# EAGLE design MPPT3 (EAGLE 7.2.0)
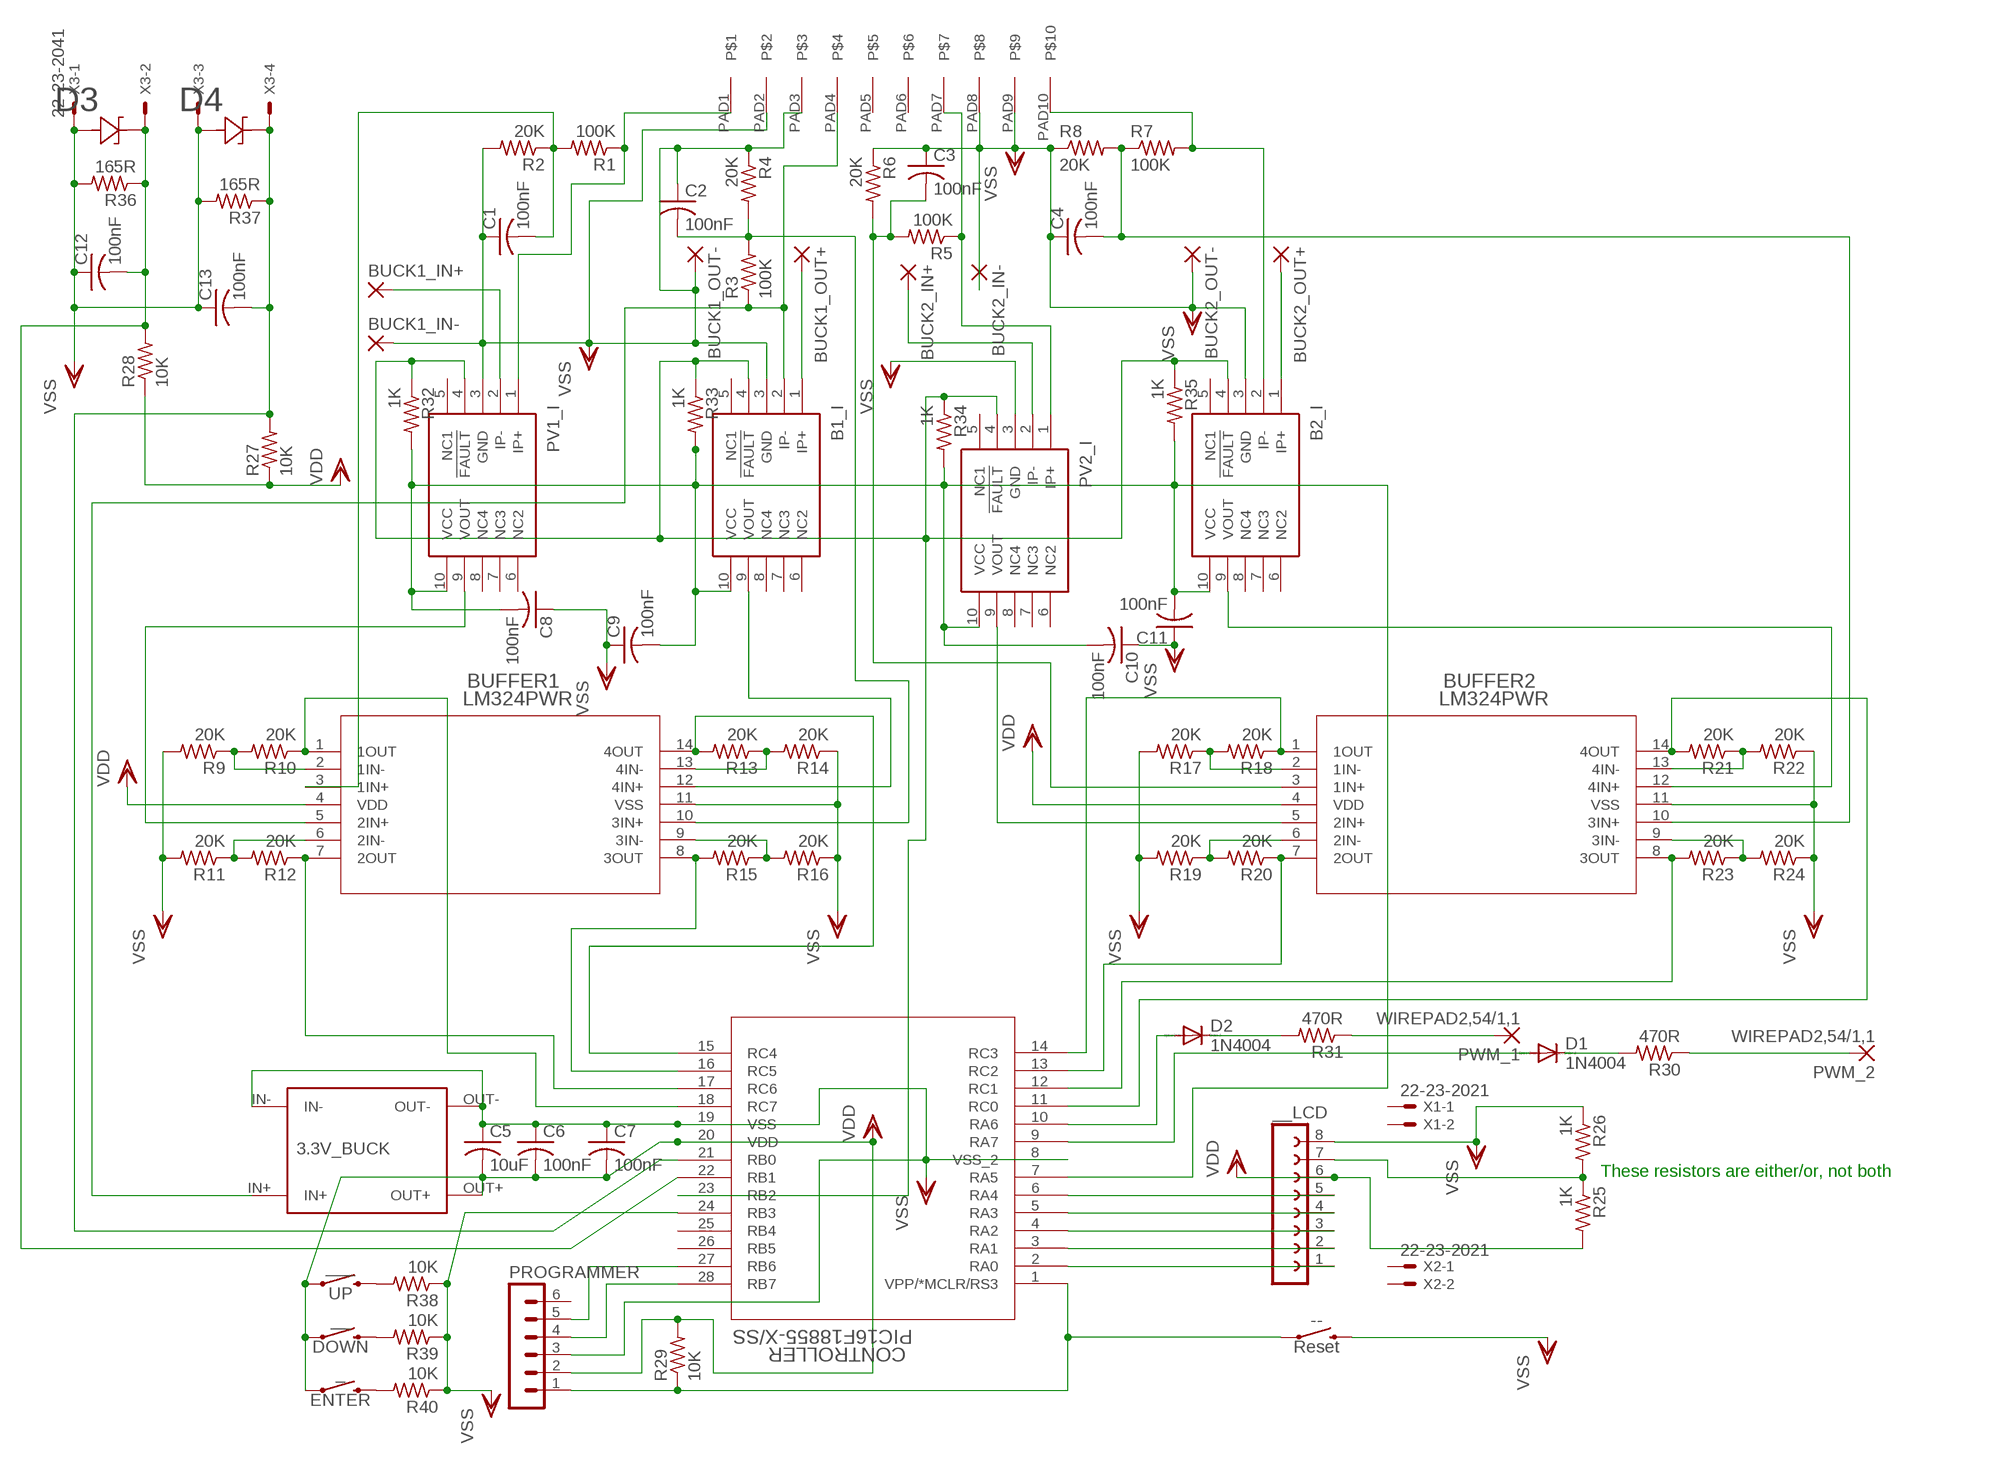
[diagram p0: schematic, sheet 1]

## Parts
3.3V_BUCK  TINY_BUCK  [TINY_BUCK]
--  Reset  MOMENTARY-SWITCH-SPST-PTH-6.0MM  [TACTILE_SWITCH_PTH_6.0MM]
_  ENTER  MOMENTARY-SWITCH-SPST-PTH-6.0MM  [TACTILE_SWITCH_PTH_6.0MM]
__  DOWN  MOMENTARY-SWITCH-SPST-PTH-6.0MM  [TACTILE_SWITCH_PTH_6.0MM]
___  UP  MOMENTARY-SWITCH-SPST-PTH-6.0MM  [TACTILE_SWITCH_PTH_6.0MM]
__LCD  FE08-1  [FE08]
B1_I  ACS711KEXLT-15AB-T  [EX-PACKAGE]
B2_I  ACS711KEXLT-15AB-T  [EX-PACKAGE]
BUCK1_IN+  3,81/1,4  [3,81/1,4]
BUCK1_IN-  3,81/1,4  [3,81/1,4]
BUCK1_OUT+  3,81/1,4  [3,81/1,4]
BUCK1_OUT-  3,81/1,4  [3,81/1,4]
BUCK2_IN+  3,81/1,4  [3,81/1,4]
BUCK2_IN-  3,81/1,4  [3,81/1,4]
BUCK2_OUT+  3,81/1,4  [3,81/1,4]
BUCK2_OUT-  3,81/1,4  [3,81/1,4]
BUFFER1  LM324PWR  [PW14]
BUFFER2  LM324PWR  [PW14]
C1  100nF  C-USC0603  [C0603]
C2  100nF  C-USC0603  [C0603]
C3  100nF  C-USC0603  [C0603]
C4  100nF  C-USC0603  [C0603]
C5  10uF  C-USC0603  [C0603]
C6  100nF  C-USC0603  [C0603]
C7  100nF  C-USC0603  [C0603]
C8  100nF  C-USC0603  [C0603]
C9  100nF  C-USC0603  [C0603]
C10  100nF  C-USC0603  [C0603]
C11  100nF  C-USC0603  [C0603]
C12  100nF  C-USC0603  [C0603]
C13  100nF  C-USC0603  [C0603]
CONTROLLER  PIC16F18855-X/SS  [SSOP28_MC]
D1  1N4004  [DO41-10]
D2  1N4004  [DO41-10]
D3  CZRU52C3V3  [CZRU]
D4  CZRU52C3V3  [CZRU]
PROGRAMMER  MA06-1  [MA06-1]
PV1_I  ACS711KEXLT-15AB-T  [EX-PACKAGE]
PV2_I  ACS711KEXLT-15AB-T  [EX-PACKAGE]
PWM_1  WIREPAD2,54/1,1  [2,54/1,1]
PWM_2  WIREPAD2,54/1,1  [2,54/1,1]
R1  100K  R-US_R0603  [R0603]
R2  20K  R-US_R0603  [R0603]
R3  100K  R-US_R0603  [R0603]
R4  20K  R-US_R0603  [R0603]
R5  100K  R-US_R1206  [R1206]
R6  20K  R-US_R0603  [R0603]
R7  100K  R-US_R0603  [R0603]
R8  20K  R-US_R0603  [R0603]
R9  20K  R-US_R0603  [R0603]
R10  20K  R-US_R0603  [R0603]
R11  20K  R-US_R0603  [R0603]
R12  20K  R-US_R0603  [R0603]
R13  20K  R-US_R0603  [R0603]
R14  20K  R-US_R0603  [R0603]
R15  20K  R-US_R0603  [R0603]
R16  20K  R-US_R0603  [R0603]
R17  20K  R-US_R0603  [R0603]
R18  20K  R-US_R0603  [R0603]
R19  20K  R-US_R0603  [R0603]
R20  20K  R-US_R0603  [R0603]
R21  20K  R-US_R0603  [R0603]
R22  20K  R-US_R0603  [R0603]
R23  20K  R-US_R0603  [R0603]
R24  20K  R-US_R0603  [R0603]
R25  1K  R-US_R0603  [R0603]
R26  1K  R-US_R0603  [R0603]
R27  10K  R-US_R1206  [R1206]
R28  10K  R-US_R0603  [R0603]
R29  10K  R-US_R0603  [R0603]
R30  470R  R-US_R0603  [R0603]
R31  470R  R-US_R1206  [R1206]
R32  1K  R-US_R1206  [R1206]
R33  1K  R-US_R1206  [R1206]
R34  1K  R-US_R0603  [R0603]
R35  1K  R-US_R0603  [R0603]
R36  165R  R-US_R0603  [R0603]
R37  165R  R-US_R0603  [R0603]
R38  10K  R-US_R0603  [R0603]
R39  10K  R-US_R0603  [R0603]
R40  10K  R-US_R0603  [R0603]
U$1  CONN-KF2EDG-10(5.08)E-BAYPLUGGABLECONNECTORS  [CONN-KF2EDG-10(5.08)]
X1  22-23-2021  [22-23-2021]
X2  22-23-2021  [22-23-2021]
X3  22-23-2041  [22-23-2041]

## Nets
N$1: BUCK1_IN+.1(P) PV1_I.2(IP-)
N$2: BUFFER1.5(2IN+) PV1_I.9(VOUT)
N$3: BUFFER1.3(1IN+) C1.2 R1.2 R2.1
N$4: ___.3 R38.2
N$5: BUFFER1.10(3IN+) C2.2 R3.2 R4.2
N$6: 3.3V_BUCK.IN+ B1_I.2(IP-) R3.1 U$1.PAD4
N$7: B1_I.9(VOUT) BUFFER1.12(4IN+)
N$8: PV2_I.1(IP+) R5.1 U$1.PAD7
N$9: BUCK2_IN+.1(P) PV2_I.2(IP-)
N$10: __.3 R39.2
N$11: B2_I.2(IP-) R7.2 U$1.PAD10
N$12: BUFFER2.10(3IN+) C4.2 R7.1 R8.2
N$13: B2_I.1(IP+) BUCK2_OUT+.1(P)
N$14: BUFFER1.9(3IN-) R15.1 R16.2
N$15: BUFFER1.1(1OUT) CONTROLLER.18(RC7) R10.1
N$16: BUFFER1.6(2IN-) R11.1 R12.2
N$17: BUFFER1.7(2OUT) CONTROLLER.17(RC6) R12.1
N$18: BUFFER1.13(4IN-) R13.1 R14.2
N$19: BUFFER1.2(1IN-) R9.1 R10.2
N$20: BUFFER1.14(4OUT) CONTROLLER.15(RC4) R13.2
N$21: BUFFER1.8(3OUT) CONTROLLER.16(RC5) R15.2
N$22: B1_I.1(IP+) BUCK1_OUT+.1(P)
N$23: __LCD.1 CONTROLLER.2(RA0)
N$24: BUFFER2.1(1OUT) CONTROLLER.14(RC3) R18.1
N$25: BUFFER2.7(2OUT) CONTROLLER.13(RC2) R20.1
N$26: BUFFER2.6(2IN-) R19.1 R20.2
N$27: BUFFER2.14(4OUT) CONTROLLER.11(RC0) R21.2
N$28: BUFFER2.13(4IN-) R21.1 R22.2
N$29: BUFFER2.8(3OUT) CONTROLLER.12(RC1) R23.2
N$30: BUFFER2.9(3IN-) R23.1 R24.2
N$31: BUFFER2.2(1IN-) R17.1 R18.2
N$32: BUFFER2.5(2IN+) PV2_I.9(VOUT)
N$33: B2_I.9(VOUT) BUFFER2.12(4IN+)
N$34: __LCD.2 CONTROLLER.3(RA1)
N$35: __LCD.3 CONTROLLER.4(RA2)
N$36: __LCD.4 CONTROLLER.5(RA3)
N$37: __LCD.5 CONTROLLER.6(RA4)
N$38: __LCD.7 R25.1 R26.2
N$39: C12.2 CONTROLLER.22(RB1) D3.1 R28.2 R36.1 X3.2
N$40: --.1 CONTROLLER.1(VPP/*MCLR/RS3) PROGRAMMER.1 R29.1
N$41: CONTROLLER.10(RA6) D2.A
N$42: C13.2 CONTROLLER.21(RB0) D4.1 R27.2 R37.1 X3.4
N$43: CONTROLLER.9(RA7) D1.A
N$44: CONTROLLER.28(RB7) PROGRAMMER.4
N$45: CONTROLLER.27(RB6) PROGRAMMER.5
N$46: PWM_2.1(P) R30.1
N$47: D1.C R30.2
N$48: PWM_1.1(P) R31.1
N$49: D2.C R31.2
N$50: PV1_I.1(IP+) R1.1 U$1.PAD1
N$51: _.3 R40.2
N$52: BUFFER2.3(1IN+) C3.2 R5.2 R6.2
N$53: B1_I.10(VCC) B2_I.10(VCC) C8.2 C9.2 C10.2 C11.2 CONTROLLER.7(RA5) PV1_I.10(VCC) PV2_I.10(VCC) R32.2 R33.2 R34.2 R35.2
N$56: B1_I.4(!FAULT) B2_I.4(!FAULT) CONTROLLER.23(RB2) PV1_I.4(!FAULT) PV2_I.4(!FAULT) R32.1 R33.1 R34.1 R35.1
VDD: 3.3V_BUCK.OUT+ _.1 __.1 ___.1 __LCD.6 BUFFER1.4(VDD) BUFFER2.4(VDD) C5.2 C6.2 C7.2 CONTROLLER.20(VDD) PROGRAMMER.2 R25.2 R27.1 R28.1 R29.2
VSS: 3.3V_BUCK.IN- 3.3V_BUCK.OUT- --.3 __LCD.8 B1_I.3(GND) B2_I.3(GND) BUCK1_IN-.1(P) BUCK1_OUT-.1(P) BUCK2_IN-.1(P) BUCK2_OUT-.1(P) BUFFER1.11(VSS) BUFFER2.11(VSS) C1.1 C2.1 C3.1 C4.1 C5.1 C6.1 C7.1 C8.1 C9.1 C10.1 C11.1 C12.1 C13.1 CONTROLLER.8(VSS_2) CONTROLLER.19(VSS) CONTROLLER.24(RB3) D3.2 D4.2 PROGRAMMER.3 PV1_I.3(GND) PV2_I.3(GND) R2.2 R4.1 R6.1 R8.1 R9.2 R11.2 R14.1 R16.1 R17.2 R19.2 R22.1 R24.1 R26.1 R36.2 R37.2 R38.1 R39.1 R40.1 U$1.PAD2 U$1.PAD3 U$1.PAD8 U$1.PAD9 X3.1 X3.3
Unconnected: B1_I.5(NC1) B1_I.6(NC2) B1_I.7(NC3) B1_I.8(NC4) B2_I.5(NC1) B2_I.6(NC2) B2_I.7(NC3) B2_I.8(NC4) CONTROLLER.25(RB4) CONTROLLER.26(RB5) PROGRAMMER.6 PV1_I.5(NC1) PV1_I.6(NC2) PV1_I.7(NC3) PV1_I.8(NC4) PV2_I.5(NC1) PV2_I.6(NC2) PV2_I.7(NC3) PV2_I.8(NC4) U$1.PAD5 U$1.PAD6 X1.1 X1.2 X2.1 X2.2

## Notes on the sheet
- These resistors are either/or, not both

## Library data of the parts
3.3V_BUCK = Tiny_Buck:TINY_BUCK: E_Bay 3 Amp Buck Converter
-- _ __ ___ = SparkFun-Switches:MOMENTARY-SWITCH-SPST: Momentary Switch (Pushbutton) - SPST Normally-open (NO) SPST momentary switches (buttons, pushbuttons). Variants PTH-12MM - 12mm square, through-hole Momentary Pushbutton Switch - 12mm Square <https://www.sparkfun.com/products/9190> (COM-09190) PTH-6.0MM, PTH-6.0MM-KIT - 6.0mm square, through-hole Mini Pushbutton Switch <https://www.sparkfun.com/products/97> (COM-00097) KIT package intended for soldering kit's - only one side of pads' copper is exposed. PTH-RIGHT-ANGLE-KIT - Right-angle, through-hole Right Angle Tactile Button <https://www.sparkfun.com/products/10791> - Used on SparkFun BigTime Watch Kit <https://www.sparkfun.com/products/11734> SMD-12MM - 12mm square, surface-mount Tactile Button - SMD (12mm) <https://www.sparkfun.com/products/12993> (COM-12993) Used on SparkFun PicoBoard <https://www.sparkfun.com/products/11888> SMD-4.5MM - 4.5mm Square Trackball Switch Used on SparkFun Blackberry Trackballer Breakout <https://www.sparkfun.com/products/13169> SMD-4.6MMX2.8MM - 4.60mm x 2.80mm, surface mount Used on SparkFun SAMD21 Mini Breakout <https://www.sparkfun.com/products/13664> SMD-5.2MM, SMD-5.2-REDUNDANT - 5.2mm square, surface-mount Mini Pushbutton Switch - SMD <https://www.sparkfun.com/products/8720> (COM-08720) Used on Arduino Pro Mini <https://www.sparkfun.com/products/11114> REDUNDANT package connects both switch circuits together SMD-6.0X3.5MM - 6.0 x 3.5mm, surface mount Momentary Reset Switch SMD <https://www.sparkfun.com/products/8229> (COM-08229) SMD-6.2MM-TALL - 6.2mm square, surface mount Tactile Button - SMD (6mm) <https://www.sparkfun.com/products/12992> Used on SparkFun Digital Sandbox <https://www.sparkfun.com/products/12651> SMD-RIGHT-ANGLE - Right-angle, surface mount Used on SparkFun Block for Intel® Edison - Arduino <https://www.sparkfun.com/products/13036>; PROD_ID: SWCH-08441; SF_SKU: COM-00097
__LCD = con-lsta:FE08-1: FEMALE HEADER; OC_FARNELL: unknown; OC_NEWARK: unknown
B1_I B2_I PV1_I PV2_I = SamacSys_Parts:ACS711KEXLT-15AB-T: Hall Effect Linear Current Sensor with Overcurrent Fault Output for <100 V Isolation Applications Source: Datasheet <https://www.arrow.com/en/products/acs711kexlt-15ab-t/allegro-microsystems>; ARROW_PART_NUMBER: ACS711KEXLT-15AB-T; DESCRIPTION: Hall Effect Linear Current Sensor with Overcurrent Fault Output for <100 V Isolation Applications; HEIGHT: mm; MANUFACTURER_NAME: Allegro Microsystems; MANUFACTURER_PART_NUMBER: ACS711KEXLT-15AB-T
BUCK1_IN+ BUCK1_IN- BUCK1_OUT+ BUCK1_OUT- BUCK2_IN+ BUCK2_IN- BUCK2_OUT+ BUCK2_OUT- = wirepad:3,81/1,4: THROUGH-HOLE PAD
BUFFER1 BUFFER2 = LM324PWR:LM324PWR; MANUFACTURER_PART_NUMBER: LM324PWR; VENDOR: Vendor
C1-C13 = resistor:C-US: CAPACITOR, American symbol
CONTROLLER = 16F18855_SSOP:PIC16F18855-X/SS; COPYRIGHT: Copyright (C) 2016 Accelerated Designs. All rights reserved; MANUFACTURER_PART_NUMBER: pic16f18855-x/ss; VENDOR: Microchip
D1 D2 = diode:1N4004: DIODE general purpose rectifier, 1 A
D3 D4 = 0603ZenerDiode:CZRU52C3V3; VENDOR: Comchip
PROGRAMMER = con-lstb:MA06-1: PIN HEADER; OC_FARNELL: unknown; OC_NEWARK: unknown
PWM_1 PWM_2 = wirepad:WIREPAD: Wire PAD connect wire on PCB
R1-R26 R28-R40 = resistor:R-US_: RESISTOR, American symbol
R27 = rcl:R-US_: RESISTOR, American symbol
U$1 = Stuff_I_Use:CONN-KF2EDG-10(5.08)
X1 X2 = con-molex:22-23-2021: .100" (2.54mm) Center Header - 2 Pin; MF: MOLEX; MPN: 22-23-2021; OC_FARNELL: 1462926; OC_NEWARK: 25C3832
X3 = con-molex:22-23-2041: .100" (2.54mm) Center Header - 4 Pin; MF: MOLEX; MPN: 22-23-2041; OC_FARNELL: 1462920; OC_NEWARK: 38C0355

## Board
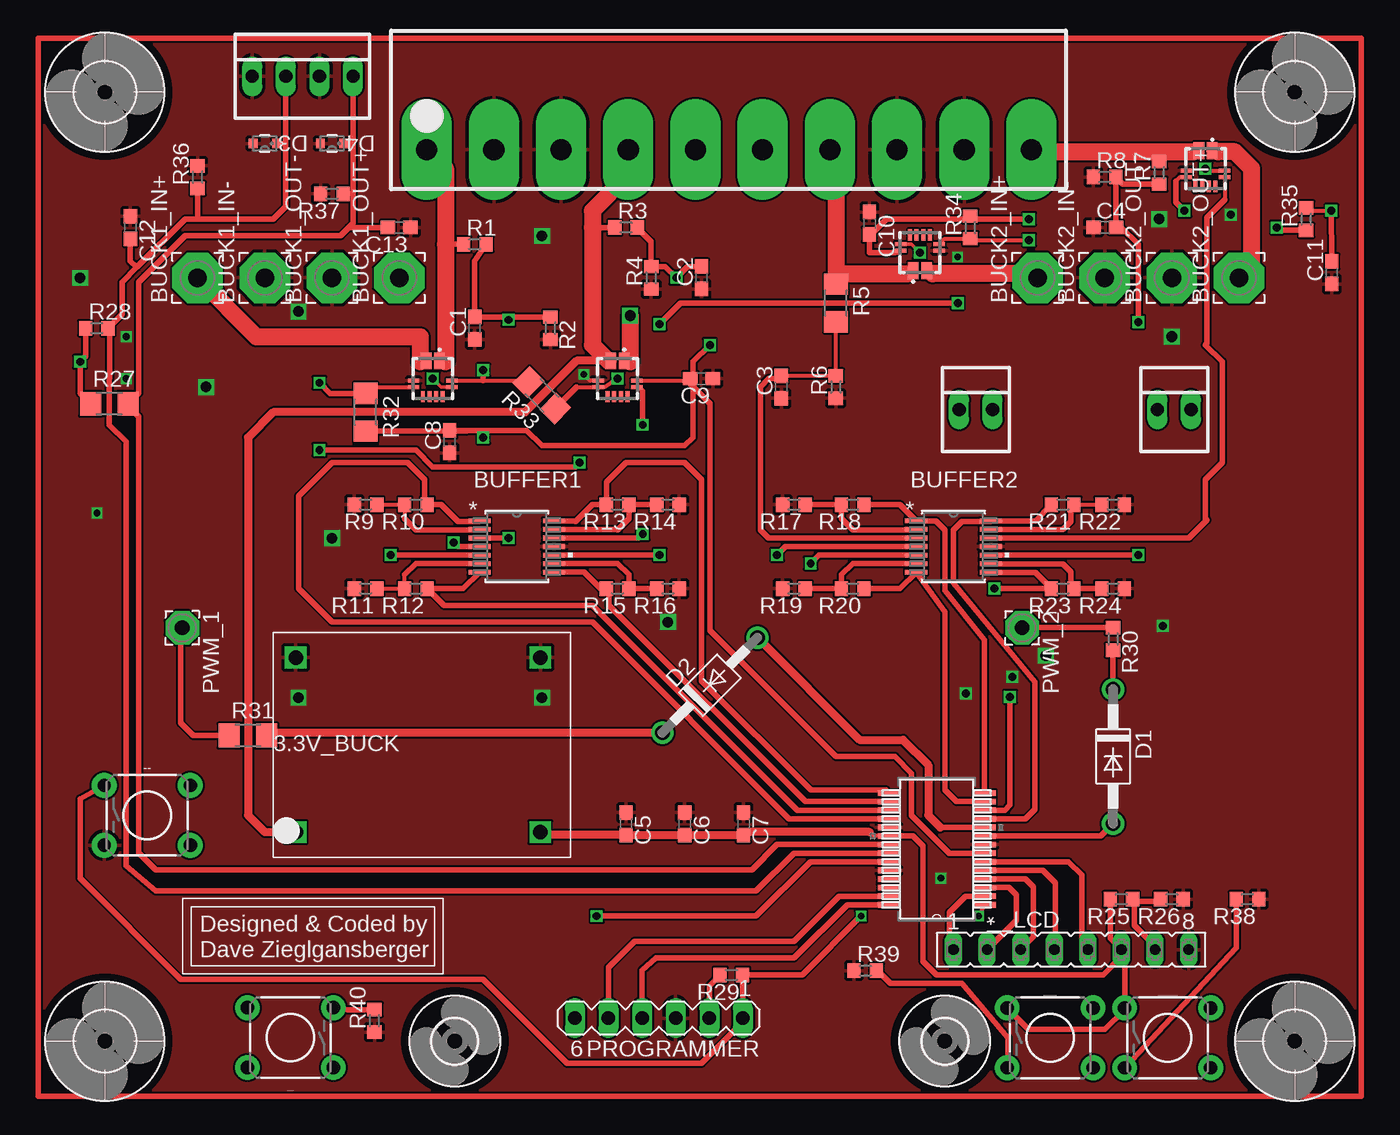
[diagram p1: board, top side]
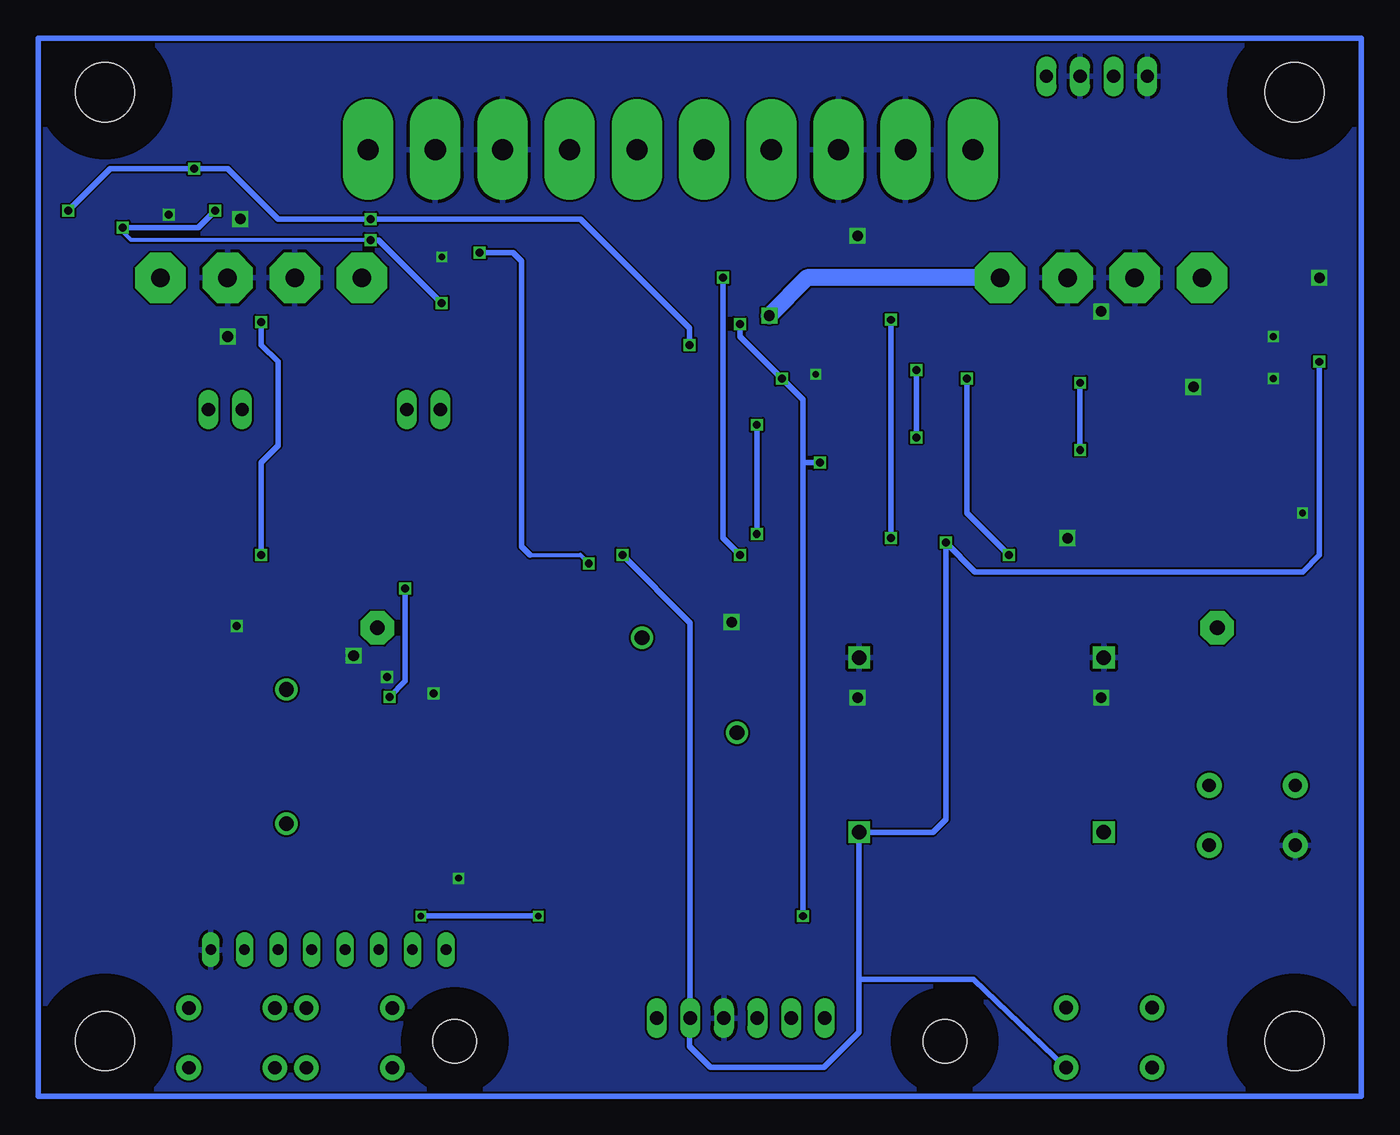
[diagram p2: board, bottom side, seen from below]

No outline drawn. Coordinates in mm, seen from the top.
Copper layers (1*16): Top 0.035mm / dielectric 1.5mm / Bottom 0.035mm
Design rules "SeeedStudio_2layer_DRU_no_angle_20140221 *": minimum track width 6mil, minimum drill 12mil, track to track 6mil, track to pad 6mil, pad to pad 6mil, via to via 6mil, smd to smd 0mil, copper to edge 10mil, drill to drill 10mil, minimum pad ring 10mil, minimum via ring 6mil, stop-mask expansion 2mil, vias tented up to drill 100mil, thermal gap 10mil

### Footprints (pad centres in the part's own frame; a part is rotated, then mirrored left to right if it is on the bottom)
TINY_BUCK = drill 1.1 square: IN+ 1.7,1.9; IN- 1.7,15.1; OUT+ 20.2,1.9; OUT- 20.2,15.1
TACTILE_SWITCH_PTH_6.0MM = drill 1.016 pad 1.88: 1 -3.251,2.261; 2 3.251,2.261; 3 -3.251,-2.261; 4 3.251,-2.261
FE08 = drill 0.813 long: 1 -8.89,0; 2 -6.35,0; 3 -3.81,0; 4 -1.27,0; 5 1.27,0; 6 3.81,0; 7 6.35,0; 8 8.89,0
EX-PACKAGE = smd 1.27 x 0.8: 1 -1.35,0.5; 2 -1.35,-0.5 | smd 0.3 x 0.85: 3 0.15,-1.45; 4 0.65,-1.45; 9 0.65,1.45; 10 0.15,1.45 | smd 0.85 x 0.3: 5 1.35,-0.75; 6 1.35,-0.25; 7 1.35,0.25; 8 1.35,0.75
3,81/1,4 = drill 1.397 pad 3.81 octagon: 1 0,0
PW14 = smd 1.676 x 0.356: 1 -2.819,1.95; 2 -2.819,1.3; 3 -2.819,0.65; 4 -2.819,0; 5 -2.819,-0.65; 6 -2.819,-1.3; 7 -2.819,-1.95; 8 2.819,-1.95; 9 2.819,-1.3; 10 2.819,-0.65; 11 2.819,0; 12 2.819,0.65; 13 2.819,1.3; 14 2.819,1.95
C0603 = smd 1.1 x 1: 1 -0.85,0; 2 0.85,0
SSOP28_MC = smd 1.676 x 0.432: 1 -3.619,4.225; 2 -3.619,3.575; 3 -3.619,2.925; 4 -3.619,2.275; 5 -3.619,1.625; 6 -3.619,0.975; 7 -3.619,0.325; 8 -3.619,-0.325; 9 -3.619,-0.975; 10 -3.619,-1.625; 11 -3.619,-2.275; 12 -3.619,-2.925; 13 -3.619,-3.575; 14 -3.619,-4.225; 15 3.619,-4.225; 16 3.619,-3.575; 17 3.619,-2.925; 18 3.619,-2.275; 19 3.619,-1.625; 20 3.619,-0.975; 21 3.619,-0.325; 22 3.619,0.325; 23 3.619,0.975; 24 3.619,1.625; 25 3.619,2.275; 26 3.619,2.925; 27 3.619,3.575; 28 3.619,4.225
DO41-10 = drill 1.118: A 5.08,0; C -5.08,0
CZRU = smd 0.66 x 0.711: 1 -0.876,0; 2 0.876,0
MA06-1 = drill 1.016 long: 1 -6.35,0; 2 -3.81,0; 3 -1.27,0; 4 1.27,0; 5 3.81,0; 6 6.35,0
2,54/1,1 = drill 1.118 pad 2.54 octagon: 1 0,0
R0603 = smd 1 x 1.1: 1 -0.85,0; 2 0.85,0
R1206 = smd 1.6 x 1.803: 1 -1.422,0; 2 1.422,0
CONN-KF2EDG-10(5.08) = drill 1.6 pad 3.81 long: PAD1 23.32,3; PAD2 18.24,3; PAD3 13.16,3; PAD4 8.08,3; PAD5 3,3; PAD6 -2.08,3; PAD7 -7.16,3; PAD8 -12.24,3; PAD9 -17.32,3; PAD10 -22.4,3
4,5 = hole 4.5: 0,0
3,3 = hole 3.3: 0,0
22-23-2021 = drill 1 long: 1 -1.27,0; 2 1.27,0
22-23-2041 = drill 1 long: 1 -3.81,0; 2 -1.27,0; 3 1.27,0; 4 3.81,0

### Placement (x,y rotation side)
3.3V_BUCK  17.75,18.08 0 top
--  8.22,21.26 0 top
_  19.05,4.45 180 top
__  76.49,4.43 0 top
___  85.38,4.43 0 top
__LCD  78.08,11.1 0 top
B1_I  43.78,54.28 270 top
B2_I  88.23,70.15 270 top
BUCK1_IN+  12.04,61.9 90 top
BUCK1_IN-  17.11,61.9 90 top
BUCK1_OUT+  27.27,61.9 90 top
BUCK1_OUT-  22.2,61.9 90 top
BUCK2_IN+  75.53,61.9 90 top
BUCK2_IN-  80.61,61.9 90 top
BUCK2_OUT+  90.78,61.9 90 top
BUCK2_OUT-  85.69,61.9 90 top
BUFFER1  36.16,41.58 0 top
BUFFER2  69.19,41.58 0 top
C1  32.99,58.09 90 top
C2  50.13,61.9 90 top
C3  56.17,53.64 90 top
C4  80.61,65.71 0 top
C5  44.42,20.62 270 top
C6  48.87,20.62 270 top
C7  53.31,20.62 270 top
C8  31.09,49.52 90 top
C9  50.13,54.28 180 top
C10  62.84,66.03 270 top
C11  97.79,62.28 90 top
C12  6.96,65.71 270 top
C13  27.27,65.71 180 top
CONTROLLER  67.92,18.72 180 top
D1  81.25,25.7 270 top
D2  50.77,31.1 45 top
D3  17.11,72.06 180 top
D4  22.2,72.06 180 top
PROGRAMMER  46.91,5.92 180 top
PV1_I  29.82,54.28 270 top
PV2_I  66.64,63.8 90 top
PWM_1  10.88,35.44 270 top
PWM_2  74.38,35.44 270 top
R1  32.99,64.44 0 top
R2  38.7,58.09 270 top
R3  44.42,65.71 0 top
R4  46.33,61.9 90 top
R5  60.3,59.99 270 top
R6  60.3,53.64 90 top
R7  84.74,69.83 90 top
R8  80.61,69.52 0 top
R9  24.73,44.75 180 top
R10  28.55,44.75 180 top
R11  24.73,38.4 180 top
R12  28.55,38.4 180 top
R13  43.78,44.75 180 top
R14  47.59,44.75 180 top
R15  43.78,38.4 180 top
R16  47.59,38.4 180 top
R17  57.12,44.75 180 top
R18  61.56,44.75 180 top
R19  57.12,38.4 180 top
R20  61.56,38.4 180 top
R21  77.44,44.75 180 top
R22  81.25,44.75 180 top
R23  77.44,38.4 180 top
R24  81.25,38.4 180 top
R25  81.89,14.91 180 top
R26  85.69,14.91 180 top
R27  5.37,52.37 0 top
R28  4.42,58.09 0 top
R29  52.39,9.18 180 top
R30  81.25,34.59 270 top
R31  15.85,27.29 0 top
R32  24.73,51.74 270 top
R33  38.07,53.01 135 top
R34  70.45,65.71 90 top
R35  95.86,66.34 90 top
R36  12.04,69.52 90 top
R37  22.2,68.25 180 top
R38  91.41,14.91 180 top
R39  62.52,9.51 0 top
R40  25.4,5.71 90 top
U$1  52.67,74.6 180 top
U$2  [4,5]  5.03,75.94 0 top
U$3  [4,5]  94.97,4.19 0 top
U$4  [4,5]  5.03,4.19 0 top
U$5  [4,5]  94.97,75.94 0 top
U$7  [DAVE]  12.18,10.53 0 top
U$8  [3,3]  31.48,4.19 0 top
U$9  [3,3]  68.53,4.19 0 top
X1  70.88,51.94 0 top
X2  85.88,51.94 0 top
X3  19.97,77.14 0 top

### Tracks (layer width: path | path; a pad name or v marks a point on that pad's centre or on a via)
N$1
  Top 0.813: 28.86,55.55 28.94,55.63 PV1_I.2
  Top 1.27: BUCK1_IN+.1 16.48,57.45 28.86,57.45 28.86,55.55
N$2  (via drill 0.6)
  Top 0.254: v29.82,54.28 30.45,53.64 31.25,53.64 PV1_I.9
  Top 0.305: 33.33,40.94 BUFFER1.5
  Top 0.406: v26.64,40.94 33.33,40.94
  Bottom 0.406: v29.82,54.28 29.82,44.12 v26.64,40.94
N$3  (via drill 0.6)
  Top 0.305: 35.52,42.23 v35.53,42.21
  Top 0.406: 35.53,58.94 C1.2 32.99,63.17 R1.2 | 35.53,58.94 R2.1 | v35.53,58.72 35.53,58.94 | BUFFER1.3 33.36,42.21 v35.53,42.21
  Bottom 0.406: v35.53,42.21 v35.53,58.72
N$4
  Top 0.406: R38.2 90.56,11.24 ___.3
N$5  (via drill 0.6)
  Top 0.305: 39,40.94 BUFFER1.10
  Top 0.406: v46.96,40.94 39,40.94 | R3.2 46.33,64.65 R4.2 47.38,62.75 v48.23,61.9 49.08,62.75 C2.2
  Bottom 0.406: v48.23,61.9 48.23,42.21 v46.96,40.94
N$6
  Top 0.406: R3.1 41.88,65.71
  Top 0.61: 43.07,55.63 40.69,55.63 36.8,51.74 17.75,51.74 15.85,49.83 15.85,21.26 17.11,19.99 3.3V_BUCK.IN+
  Top 0.813: 43.07,55.63 B1_I.2
  Top 1.27: 43.07,55.63 41.88,56.82 41.88,65.71 41.88,66.98 44.59,69.69 U$1.PAD4
N$7  (via drill 0.6)
  Top 0.305: B1_I.9 45.39,53.63 45.69,53.33
  Top 0.406: BUFFER1.12 45.39,42.23 v45.69,42.53 | 45.69,53.33 v45.69,50.78
  Bottom 0.406: v45.69,42.53 v45.69,50.78
N$8
  Top 0.813: 65.69,62.22 65.93,62.45 PV2_I.1
  Top 1.27: 65.69,62.22 60.4,62.22 R5.1 60.3,71.14 U$1.PAD7
N$9
  Top 0.813: 67.6,62.22 67.36,62.45 PV2_I.2
  Top 1.27: BUCK2_IN+.1 75.22,62.22 67.6,62.22
N$10
  Top 0.406: __.3 73.31,2.88 73.31,4.43 69.82,8.56 64.42,8.56 63.47,9.51 R39.2
N$11
  Top 0.305: R7.2 84.42,71
  Top 0.406: R7.2 84.74,71.42
  Top 0.813: 87.28,71.42 87.36,71.5 B2_I.2
  Top 1.27: U$1.PAD10 75.25,71.42 84.74,71.42 87.28,71.42
N$12  (via drill 0.6)
  Top 0.305: 72.02,40.94 BUFFER2.10
  Top 0.406: v83.16,40.94 72.02,40.94 | v83.16,58.56 83.16,64.44 81.89,65.71 C4.2 R8.2 82,68.98 R7.1
  Bottom 0.406: v83.16,40.94 83.16,47.93 81.89,49.2 81.89,55.55 83.16,56.82 v83.16,58.56
N$13
  Top 0.813: 89.19,71.42 88.73,71.42 B2_I.1
  Top 1.27: BUCK2_OUT+.1 91.73,62.85 91.73,70.15 90.46,71.42 89.19,71.42
N$14
  Top 0.305: BUFFER1.9 39.01,40.31
  Top 0.406: 39.01,40.31 43.78,40.31 44.63,39.46 R15.1 R16.2
N$15
  Top 0.305: 33.3,43.48 BUFFER1.1 | 29.18,44.97 R10.1
  Top 0.406: R10.1 30.45,44.75 31.72,43.48 33.3,43.48 | CONTROLLER.18 56.75,20.99 41.88,35.86 22.2,35.86 19.66,38.4 19.66,45.39 22.2,47.93 27.91,47.93 29.18,46.66 29.18,44.97
N$16
  Top 0.305: R11.1 R12.2 27.7,39.46 | 33.32,40.31 BUFFER1.6
  Top 0.406: 27.7,39.46 28.55,40.31 33.32,40.31
N$17
  Top 0.305: 33.3,39.67 BUFFER1.7
  Top 0.406: BUFFER1.7 32.12,38.4 R12.1 30.66,37.13 41.88,37.13 57.37,21.64 CONTROLLER.17
N$18
  Top 0.305: 43.76,42.88 43.78,42.85
  Top 0.406: BUFFER1.13 43.76,42.88 | 43.78,42.85 44.63,43.7 R13.1 R14.2
N$19
  Top 0.305: R9.1 R10.2 27.7,43.7 | 33.32,42.85 BUFFER1.2
  Top 0.406: 27.7,43.7 28.55,42.85 33.32,42.85
N$20
  Top 0.305: 40.56,43.53 40.61,43.48 | 64.08,23.16 CONTROLLER.15
  Top 0.406: BUFFER1.14 40.56,43.53 | 40.61,43.48 41.88,44.75 R13.2 42.94,46.44 44.42,47.93 48.87,47.93 50.13,46.66 50.13,31.42 58.39,23.16 64.08,23.16
N$21
  Top 0.305: BUFFER1.8 39.03,39.67 | 42.52,38.4 R15.2 43.15,38.19
  Top 0.406: 39.03,39.67 41.24,39.67 42.52,38.4 | 43.15,38.19 43.15,37.13 57.99,22.29 CONTROLLER.16
N$22  (via drill 0.8)
  Top 0.813: 44.74,55.55 44.37,55.55 B1_I.1
  Top 1.27: v44.74,59.04 44.74,55.55
  Bottom 1.27: BUCK1_OUT+.1 41.88,61.9 v44.74,59.04
N$23
  Top 0.406: CONTROLLER.2 70.08,15.14 68.88,13.94 68.88,11.41 __LCD.1
N$24
  Top 0.305: 71.53,23.13 CONTROLLER.14
  Top 0.406: R18.1 65.14,44.75 BUFFER2.1 67.87,43.53 68.55,42.85 68.55,38.27 71.53,34.5 71.53,23.13
N$25
  Top 0.406: R20.1 65.14,38.4 BUFFER2.7 68.55,36.64 68.55,23.16 69.42,22.29 CONTROLLER.13
N$26
  Top 0.305: 66.34,40.31 BUFFER2.6
  Top 0.406: R19.1 R20.2 60.72,39.46 61.56,40.31 66.34,40.31
N$27
  Top 0.305: 71.96,43.48 BUFFER2.14
  Top 0.406: BUFFER2.14 75.36,43.53 R21.2 | CONTROLLER.11 74.64,20.99 75.33,21.69 75.33,31.36 69.19,38.81 69.19,42.85 69.82,43.48 71.96,43.48
N$28
  Top 0.305: 78.08,44.54 R21.1 R22.2
  Top 0.406: BUFFER2.13 77.47,42.88 78.08,43.48 78.08,44.54
N$29  (via drill 0.6)
  Top 0.406: BUFFER2.8 75.36,39.63 R23.2 v72.27,38.4 | CONTROLLER.12 73.08,21.64 73.47,22.03 v73.47,30.22
  Bottom 0.406: v73.47,30.22 72.27,31.42 v72.27,38.4
N$30
  Top 0.305: 78.08,38.62 R23.1
  Top 0.406: BUFFER2.9 77.47,40.28 78.08,39.67 78.08,38.62 | R23.1 R24.2
N$31
  Top 0.305: 66.34,42.85 BUFFER2.2
  Top 0.406: R17.1 R18.2 60.72,43.7 61.56,42.85 66.34,42.85
N$32  (via drill 0.6)
  Top 0.254: 65.21,64.44 66.01,64.44 v66.64,63.8
  Top 0.305: 66.35,40.94 BUFFER2.5 | PV2_I.9 65.21,64.44
  Top 0.406: v58.39,40.31 59.02,40.94 66.35,40.94
  Bottom 0.305: 62.84,40.94 59.02,40.94 v58.39,40.31
  Bottom 0.406: 62.84,40.94 63.47,41.58 63.47,63.17 64.11,63.8 v66.64,63.8
N$33
  Top 0.305: B2_I.9 89.69,67.79 | 72.02,42.21 BUFFER2.12
  Top 0.406: 89.69,67.79 88.33,66.44 88.33,56.92 88.23,56.82 89.5,55.55 89.5,47.93 88.23,46.66 88.23,43.68 88.33,43.58 86.97,42.21 72.02,42.21
N$34
  Top 0.406: CONTROLLER.3 73.38,15.79 73.95,15.22 73.95,13.32 __LCD.2
N$35
  Top 0.406: CONTROLLER.4 74.64,16.44 75.22,15.86 75.22,12.05 __LCD.3
N$36
  Top 0.406: CONTROLLER.5 75.94,17.09 76.88,16.16 76.88,11.17 __LCD.4
N$37
  Top 0.406: CONTROLLER.6 77.88,17.74 78.88,16.75 78.88,11.57 __LCD.5
N$38
  Top 0.406: __LCD.7 84.42,11.39 82.88,12.94 82.88,14.77 | 82.88,14.77 R25.1 | 82.88,14.77 84.7,14.77 R26.2
N$39
  Top 0.406: 7.43,62.69 11.08,66.34 12.04,66.34 | 7.43,62.69 6.32,61.58 6.32,59.14 R28.2 5.37,57.67 5.36,50.78 6.64,49.51 6.64,17.45 8.86,15.54 54.26,15.54 57.11,18.39 CONTROLLER.22 | 12.04,66.34 17.75,66.34 18.7,67.3 18.7,72.06 | 18.7,72.06 X3.2 | D3.1 18.7,72.06 | R36.1 12.04,66.34 | C12.2 6.96,63.17 7.43,62.69
N$40  (via drill 0.5)
  Top 0.305: CONTROLLER.1 v71.09,13.64
  Top 0.406: v62.2,13.64 57.76,9.19 R29.1 PROGRAMMER.1 53.26,5.65 50.13,2.52 39.98,2.52 33.62,8.88 10.77,8.88 3.15,16.5 3.15,22.49 --.1
  Bottom 0.406: v71.09,13.64 v62.2,13.64
N$41
  Top 0.406: 68.19,20.34 CONTROLLER.10
  Top 0.61: D2.A 62.08,26.97 65.38,26.97 67.28,25.07 67.28,21.26 68.19,20.34
N$42
  Top 0.406: CONTROLLER.21 55.86,19.04 53.95,17.13 8.86,17.13 7.59,18.4 7.59,51.42 6.79,52.22 R27.2 7.59,53.17 7.59,61.58 11.08,65.07 22.83,65.07 23.46,65.71 | 23.46,65.71 23.78,66.03 23.78,68.25 | 23.78,68.25 23.78,72.06 | 23.78,72.06 X3.4 | D4.1 23.78,72.06 | R37.1 23.78,68.25 | C13.2 23.46,65.71
N$43
  Top 0.406: CONTROLLER.9 80.32,19.69 D1.A
N$44
  Top 0.406: CONTROLLER.28 61.15,14.49 57.12,10.46 46.67,10.46 45.64,9.53 PROGRAMMER.4
N$45
  Top 0.406: CONTROLLER.27 60.53,15.14 57.12,11.73 45.07,11.73 43.1,9.76 PROGRAMMER.5
N$46
  Top 0.406: R30.1 PWM_2.1
N$47
  Top 0.406: D1.C R30.2
N$48
  Top 0.406: R31.1 11.72,27.29 10.77,28.24 10.77,35.33 PWM_1.1
N$49
  Top 0.61: R31.2 17.48,27.51 D2.C
N$50
  Top 0.406: R1.1 30.77,64.44
  Top 0.813: 30.77,55.55 30.69,55.63 PV1_I.1
  Top 1.27: U$1.PAD1 30.77,70.19 30.77,64.44 30.77,55.55
N$51
  Top 0.406: _.3 23.36,6.55 R40.2
N$52
  Top 0.305: C3.2 R6.2 R5.2
  Top 0.406: BUFFER2.3 55.2,42.23 54.58,42.85 54.58,53.64 55.22,54.28 55.95,54.28 C3.2
N$53  (via drill 0.6)
  Top 0.305: 88.39,70 B2_I.10 | R35.2 96.07,66.98 v97.76,66.98 | 64.74,63.8 65.05,63.8 PV2_I.10 | PV1_I.10 33.62,54.13 37.06,54.13 R33.2 | B1_I.10 49.28,54.13 C9.2
  Top 0.406: C11.2 97.76,67.19 v97.76,66.98 | v88.23,70.15 88.39,70 | 64.74,63.8 62.84,63.8 C10.2 62.94,65.17 64.11,66.34 70.24,66.34 R34.2 70.67,66.34 v74.9,66.34 | R32.2 32.35,50.32 C8.2 33.67,50.37 | 33.67,50.37 36.9,50.37 38.07,49.2 48.87,49.2 49.5,49.83 49.5,54.06 | 49.5,54.06 C9.2 49.28,53.86 50.77,52.37 50.77,35.23 60.3,25.7 64.74,25.7 66.01,24.43 66.01,21.26 68.88,18.39 CONTROLLER.7 | 33.67,50.37 33.67,49.88 v33.62,49.83 | v33.62,54.91 33.62,54.13 | 49.5,54.06 49.5,55.55 v50.77,56.82
  Bottom 0.406: v97.76,66.98 94.58,70.15 v88.23,70.15 85.69,70.15 81.89,66.34 v74.9,66.34 59.02,66.34 50.77,58.09 v50.77,56.82 | v33.62,49.83 v33.62,54.91
N$54
  Bottom 0.406: 0,0 0,80 100,80 100,0 0,0
N$55
  Top 0.406: 0,0 0,80 100,80 100,0 0,0
N$56  (via drill 0.6)
  Top 0.254: B1_I.4 42.82,53.63 v43.78,54.28
  Top 0.305: B2_I.4 86.31,69.5 86.01,69.2 | 40.7,53.63 B1_I.4 | R32.1 25.2,53.63 PV1_I.4 | PV2_I.4 68.5,64.86 R34.1 70.56,64.75 v74.9,64.75
  Top 0.406: 86.01,69.2 86.01,67.61 v86.65,66.98 | R35.1 93.63,65.49 v93.63,65.71 | R33.1 40.7,53.63 | CONTROLLER.23 58.37,17.74 54.26,13.64 v42.2,13.64 | R32.1 22.04,53.16 v21.24,53.96 | v21.24,48.88 28.55,48.88 29.82,47.61 40.61,47.61 v40.93,47.93 | v46.96,58.41 48.55,59.99 v69.5,59.99
  Bottom 0.305: v74.9,64.75 93,64.75 93.63,65.39 v93.63,65.71
  Bottom 0.406: v86.65,66.98 87.92,65.71 v93.63,65.71 | v42.2,13.64 42.2,47.93 | 42.2,47.93 42.2,52.69 v43.78,54.28 46.96,57.45 v46.96,58.41 | v21.24,53.96 v21.24,48.88 | v40.93,47.93 42.2,47.93 | v69.5,59.99 74.27,64.75 v74.9,64.75
VDD  (via drill 0.6)
  Top 0.305: CONTROLLER.20 63.17,19.69 62.84,19.99
  Top 0.406: BUFFER1.4 31.72,41.58 v31.4,41.9 | R25.2 81.03,11.95 __LCD.6 | CONTROLLER.20 66.12,19.69 66.88,18.94 66.88,10.21 67.88,9.21 80.51,9.21 81.89,10.58 __LCD.6 | R28.1 3.56,55.97 v3.15,55.55 3.15,53.17 R27.1 | R29.2 50.72,8.36 PROGRAMMER.2 | BUFFER2.4 56.48,41.58 v55.85,40.94 | __LCD.6 82.13,10.86 ___.1 82.13,6.56 80.64,5.08 74.85,5.08 __.1
  Top 0.61: 62.84,19.99 53.73,19.99 C7.2 C6.2 C5.2 38.16,19.77 3.3V_BUCK.OUT+
  Bottom 0.406: 37.95,8.88 3.3V_BUCK.OUT+ 32.36,19.98 31.4,20.94 v31.4,41.9 29.18,39.67 4.42,39.67 3.15,40.94 v3.15,55.55 3.15,55.76 | 37.95,8.88 37.95,4.87 40.61,2.21 49.18,2.21 50.77,3.79 50.77,5.87 PROGRAMMER.2 50.72,35.81 v55.85,40.94 | _.1 29.29,8.88 37.95,8.88
VSS  (via drill 0.5, 0.6, 0.8)
  Top 0.305: B1_I.3 41.71,54.13 v41.24,54.59
  other vias: 22.2,42.21 84.74,66.34 85.69,57.45 3.15,61.9 19.66,59.36 47.59,35.86 19.66,30.15 38.07,30.15 6.64,57.45 6.64,54.28 90.14,66.66 85.01,35.56 70.14,30.46 4.42,44.12 38.07,65.07 12.67,53.64 76.17,33.32 73.63,31.73 68.23,16.5 69.5,63.48
  pour Bottom: 0,0 100,0 100,80 0,80
  pour Top: 0,80.01 100.33,80.01 100.33,0 0,0